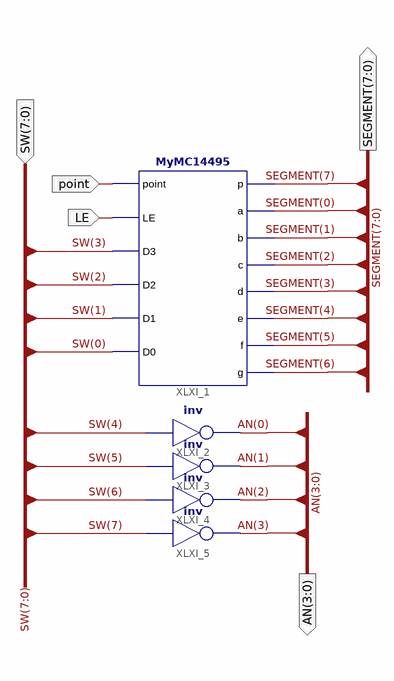
[diagram p0: schematic sheet 1]
// Xilinx ISE schematic DispNumber_sch.sch (kintex7) as structural Verilog: 5 symbols, 5 ports
module DispNumber_sch (
  input  [7:0] SW,
  input  point,
  input  LE,
  output [7:0] SEGMENT,
  output [3:0] AN
);

  MyMC14495 XLXI_1 (
    .point(point), .LE(LE), .D3(SW[3]), .D2(SW[2]), .D1(SW[1]), .D0(SW[0]), .p(SEGMENT[7]), .a(SEGMENT[0]),
    .b(SEGMENT[1]), .c(SEGMENT[2]), .d(SEGMENT[3]), .e(SEGMENT[4]), .f(SEGMENT[5]), .g(SEGMENT[6]));
  not XLXI_2 (AN[0], SW[4]);
  not XLXI_3 (AN[1], SW[5]);
  not XLXI_4 (AN[2], SW[6]);
  not XLXI_5 (AN[3], SW[7]);
endmodule
